# EAGLE schematic queso_dip_v49 (EAGLE 6.5.0)
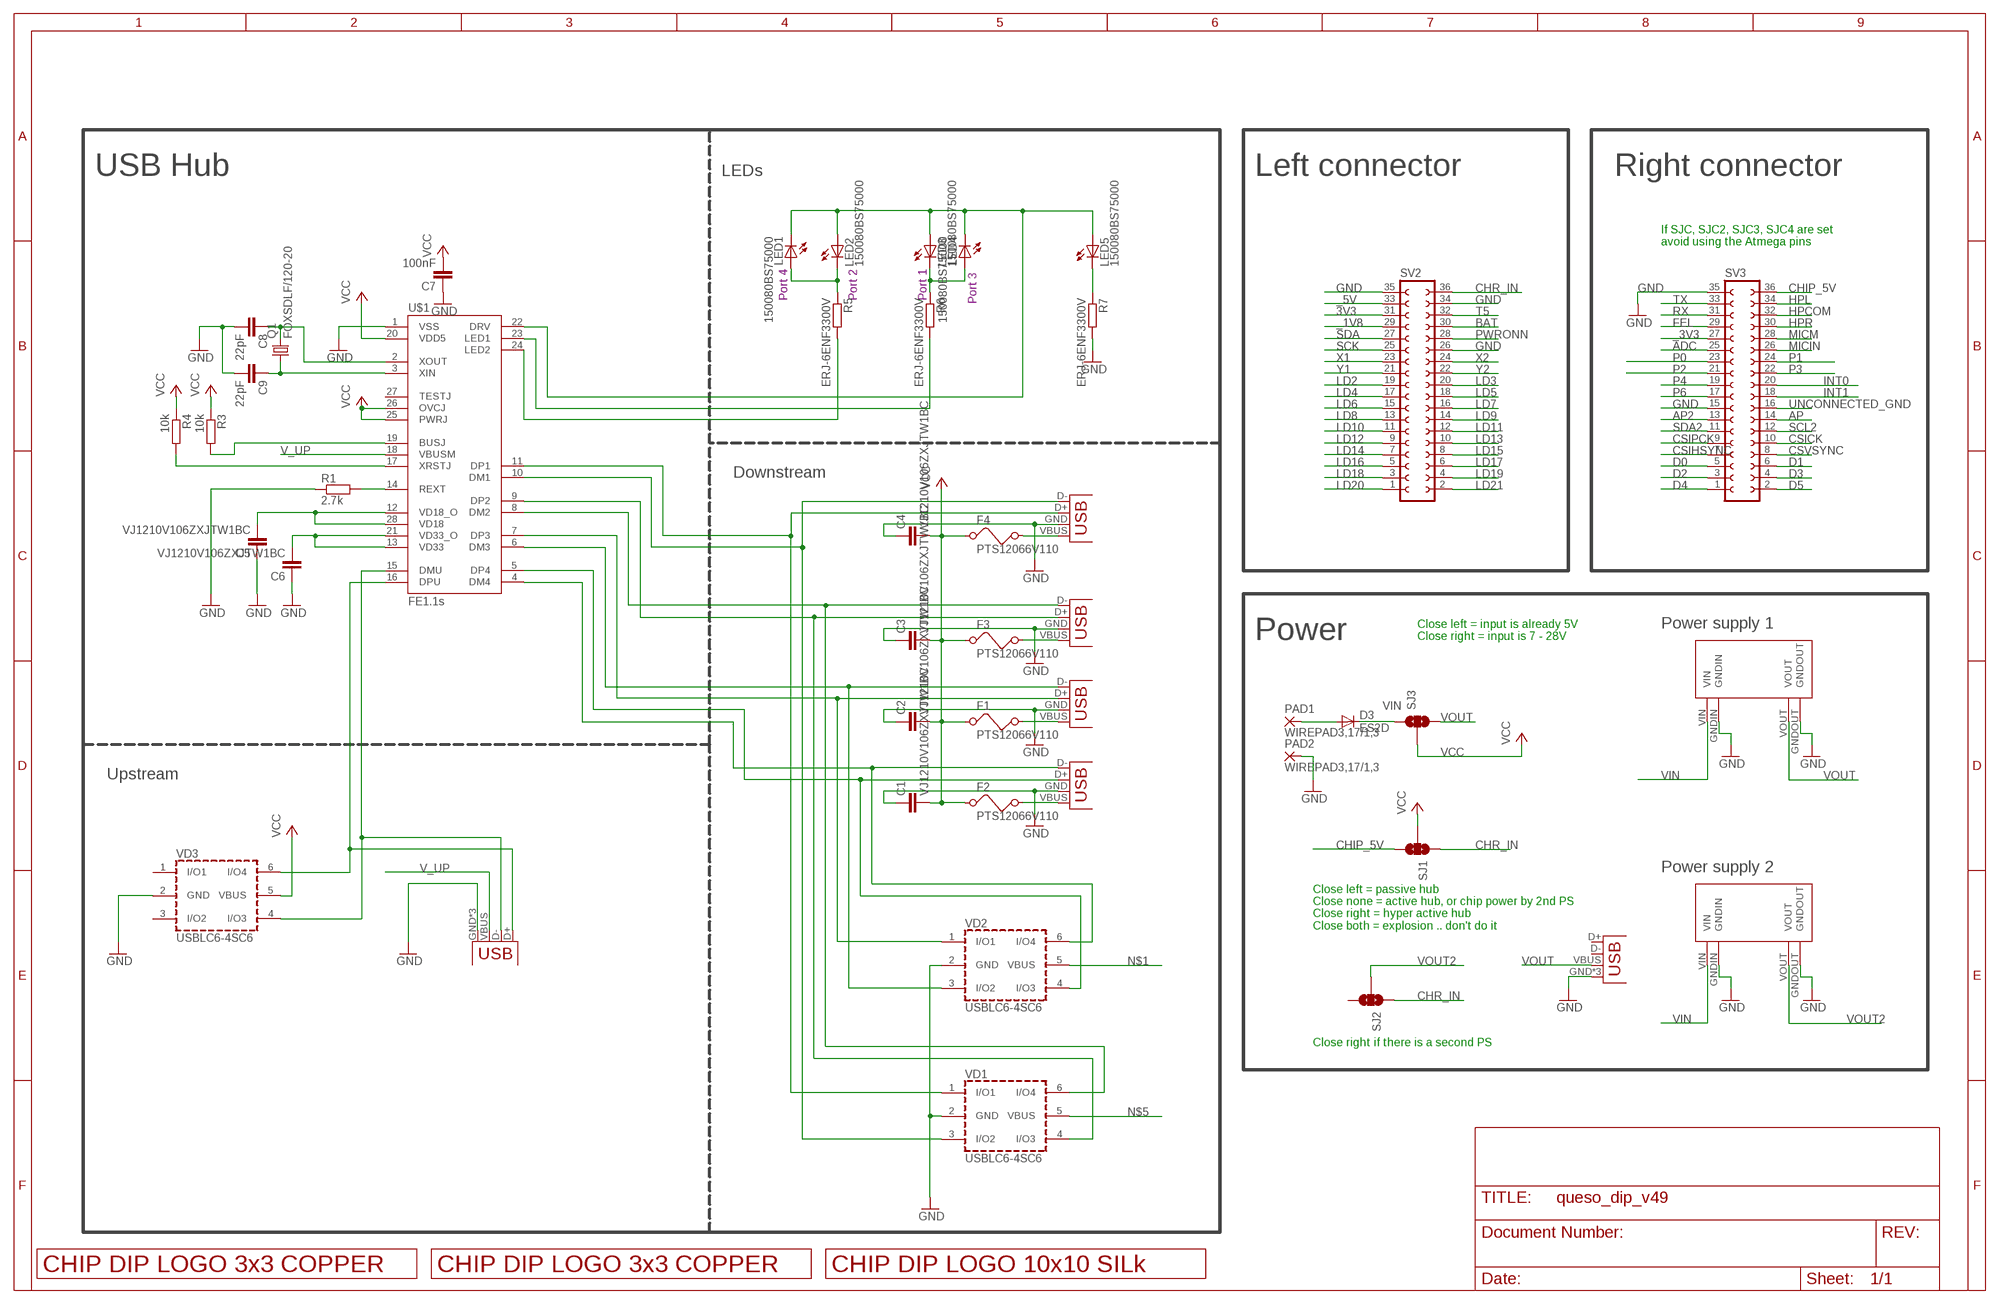
[diagram p0: schematic, sheet 1]

## Parts
C1  VJ1210V106ZXJTW1BC  C-EUC1210  [C1210]
C2  VJ1210V106ZXJTW1BC  C-EUC1210  [C1210]
C3  VJ1210V106ZXJTW1BC  C-EUC1210  [C1210]
C4  VJ1210V106ZXJTW1BC  C-EUC1210  [C1210]
C5  VJ1210V106ZXJTW1BC  C-EUC1210  [C1210]
C6  VJ1210V106ZXJTW1BC  C-EUC1210  [C1210]
C7  100nF  C-EUC0805  [C0805]
C8  22pF  C-EUC0805  [C0805]
C9  22pF  C-EUC0805  [C0805]
D3  ES2D  [SMB]
DATA_USB  USBUSB-MICROB-SMT-DIP  [USB-MICROB-SMT-DIP]
F1  PTS12066V110  FUSED  [1210]
F2  PTS12066V110  FUSED  [1210]
F3  PTS12066V110  FUSED  [1210]
F4  PTS12066V110  FUSED  [1210]
LED1  150080BS75000  LEDCHIP-LED0805  [CHIP-LED0805]
LED2  150080BS75000  LEDCHIP-LED0805  [CHIP-LED0805]
LED3  150080BS75000  LEDCHIP-LED0805  [CHIP-LED0805]
LED4  150080BS75000  LEDCHIP-LED0805  [CHIP-LED0805]
LED5  150080BS75000  LEDCHIP-LED0805  [CHIP-LED0805]
PAD1  WIREPAD3,17/1,3  [3,17/1,3]
PAD2  WIREPAD3,17/1,3  [3,17/1,3]
POWER_USB  USBUSB-MICROB-SMT-DIP  [USB-MICROB-SMT-DIP]
Q1  FOXSDLF/120-20  CRYSTALSM49  [SM49]
R1  2.7k  R-EU_R0805  [R0805]
R3  10k  R-EU_R0805  [R0805]
R4  10k  R-EU_R0805  [R0805]
R5  ERJ-6ENF3300V  R-EU_R0805  [R0805]
R6  ERJ-6ENF3300V  R-EU_R0805  [R0805]
R7  ERJ-6ENF3300V  R-EU_R0805  [R0805]
SJ1  SOLDERJUMPER_2WAYT  [SJ_2]
SJ2  SOLDERJUMPER_2WAYT  [SJ_2]
SJ3  SOLDERJUMPER_2WAYT  [SJ_2]
SV2  FE18-2  [FE18-2]
SV3  FE18-2  [FE18-2]
U$1  FE1.1S  [FE1.1S_SSOP-28]
U$2  LOGO_3X3_COPPER  [LOGO_3X3_COPPER]
U$3  MP1584EN  [MP1584EN]
U$4  LOGO_3X3_COPPER  [LOGO_3X3_COPPER]
U$5  LOGO_10X10_SILK  [LOGO_10X10_SILK]
U$9  MP1584EN  [MP1584EN]
VD1  USBLC6-4SC6  [SOT-23-6L]
VD2  USBLC6-4SC6  [SOT-23-6L]
VD3  USBLC6-4SC6  [SOT-23-6L]
X1  USB-A-HU  [USB-A-HU]
X2  USB-A-HU  [USB-A-HU]
X3  USB-A-HU  [USB-A-HU]
X4  USB-A-HU  [USB-A-HU]

## Nets
3V3: SV2.31
_1V8: SV2.29
_3V3: SV3.27
_5V: SV2.33
ADC: SV3.25
AP: SV3.14
AP2: SV3.13
BAT: SV2.30
CHIP_5V: SJ1.3 SV3.36
CHR_IN: SJ1.1 SJ2.1 SV2.36
CSICK: SV3.10
CSIHSYNC: SV3.7
CSIPCK: SV3.9
CSVSYNC: SV3.8
D0: SV3.5
D1: SV3.6
D2: SV3.3
D3: SV3.4
D4: SV3.1
D5: SV3.2
DM1: U$1.10(DM1) VD1.3(I/O2) X4.D-(D+)
DM2: U$1.8(DM2) VD1.6(I/O4) X3.D-(D+)
DM3: U$1.6(DM3) VD2.3(I/O2) X2.D-(D+)
DM4: U$1.4(DM4) VD2.6(I/O4) X1.D-(D+)
DMU: DATA_USB.D- U$1.15(DMU) VD3.4(I/O3)
DP1: U$1.11(DP1) VD1.1(I/O1) X4.D+(D-)
DP2: U$1.9(DP2) VD1.4(I/O3) X3.D+(D-)
DP3: U$1.7(DP3) VD2.1(I/O1) X2.D+(D-)
DP4: U$1.5(DP4) VD2.4(I/O3) X1.D+(D-)
DPU: DATA_USB.D+ U$1.16(DPU) VD3.6(I/O4)
FEL: SV3.29
GND: C1.1 C2.1 C3.1 C4.1 C5.1 C6.1 C7.1 C8.2 C9.2 DATA_USB.GND DATA_USB.MT1(GND) DATA_USB.MT2(GND) PAD2.1(P) POWER_USB.GND POWER_USB.MT1(GND) POWER_USB.MT2(GND) R1.1 R7.2 SV2.26 SV2.34 SV2.35 SV3.15 SV3.35 U$1.1(VSS) U$3.GNDIN U$3.GNDOUT U$9.GNDIN U$9.GNDOUT VD1.2(GND) VD2.2(GND) VD3.2(GND) X1.GND(VBUS) X2.GND(VBUS) X3.GND(VBUS) X4.GND(VBUS)
HPCOM: SV3.32
HPL: SV3.34
HPR: SV3.30
INT0: SV3.20
INT1: SV3.18
LD2: SV2.19
LD3: SV2.20
LD4: SV2.17
LD5: SV2.18
LD6: SV2.15
LD7: SV2.16
LD8: SV2.13
LD9: SV2.14
LD10: SV2.11
LD11: SV2.12
LD12: SV2.9
LD13: SV2.10
LD14: SV2.7
LD15: SV2.8
LD16: SV2.5
LD17: SV2.6
LD18: SV2.3
LD19: SV2.4
LD20: SV2.1
LD21: SV2.2
MICIN: SV3.26
MICM: SV3.28
N$1: F2.2 VD2.5(VBUS) X1.VBUS(GND)
N$2: D3.A PAD1.1(P)
N$3: F4.2 X4.VBUS(GND)
N$4: F1.2 X2.VBUS(GND)
N$5: F3.2 VD1.5(VBUS) X3.VBUS(GND)
N$14: R5.2 U$1.24(LED2)
N$15: R6.2 U$1.23(LED1)
N$17: C6.2 U$1.13(VD33) U$1.21(VD33_O)
N$18: C5.2 U$1.12(VD18_O) U$1.28(VD18)
N$22: R1.2 U$1.14(REXT)
N$24: R4.2 U$1.17(XRSTJ)
N$25: R3.2 U$1.19(BUSJ)
N$27: C8.1 Q1.2 U$1.2(XOUT)
N$28: C9.1 Q1.1 U$1.3(XIN)
N$29: LED5.C R7.1
N$30: LED3.C LED4.A R6.1
N$31: LED1.A LED2.C R5.1
N$32: LED1.C LED2.A LED3.A LED4.C LED5.A U$1.22(DRV)
P0: SV3.23
P1: SV3.24
P2: SV3.21
P3: SV3.22
P4: SV3.19
P6: SV3.17
PWRONN: SV2.28
RX: SV3.31
SCK: SV2.25
SCL2: SV3.12
SDA: SV2.27
SDA2: SV3.11
T5: SV2.32
TX: SV3.33
UNCONNECTED_GND: SV3.16
V_UP: DATA_USB.VBUS U$1.18(VBUSM)
VCC: C1.2 C2.2 C3.2 C4.2 C7.2 F1.1 F2.1 F3.1 F4.1 R3.1 R4.1 SJ1.2 SJ3.2 U$1.20(VDD5) U$1.25(PWRJ) U$1.26(OVCJ) VD3.5(VBUS)
VIN: D3.C SJ3.1 U$3.VIN U$9.VIN
VOUT: POWER_USB.VBUS SJ3.3 U$9.VOUT
VOUT2: SJ2.2 U$3.VOUT
X1: SV2.23
X2: SV2.24
Y1: SV2.21
Y2: SV2.22
Unconnected: POWER_USB.D+ POWER_USB.D- SJ2.3 U$1.27(TESTJ) VD3.1(I/O1) VD3.3(I/O2)

## Notes on the sheet
- USB Hub | LEDs | Left connector | Right connector
- If SJC, SJC2, SJC3, SJC4 are set 
  avoid using the Atmega pins
- Port 4 | Port 2 | Port 1
- Port 3
- Downstream
- Power supply 1
- Power
- Close left = input is already 5V
  Close right = input is 7 - 28V
- Upstream
- Power supply 2
- Close left = passive hub
  Close none = active hub, or chip power by 2nd PS
  Close right = hyper active hub
  Close both = explosion .. don't do it
- Close right if there is a second PS

## Library data of the parts
C1-C9 = rcl:C-EU: CAPACITOR, European symbol
D3 = diode:ES2D: DIODE super fast rectifier, 2 A
DATA_USB POWER_USB = Spark:USB
F1-F4 = m-pad-2.1:FUSE: Fuse's in various packages
LED1-LED5 = led:LED: LED OSRAM: - CHIPLED LG R971, LG N971, LY N971, LG Q971, LY Q971, LO R971, LY R971 LH N974, LH R974 LS Q976, LO Q976, LY Q976 LO Q996 - Hyper CHIPLED LW Q18S LB Q993, LB Q99A, LB R99A - SideLED LS A670, LO A670, LY A670, LG A670, LP A670 LB A673, LV A673, LT A673, LW A673 LH A674 LY A675 LS A676, LA A676, LO A676, LY A676, LW A676 LS A679, LY A679, LG A679 - Hyper Micro SIDELED® LS Y876, LA Y876, LO Y876, LY Y876 LT Y87S - SmartLED LW L88C, LW L88S LB L89C, LB L89S, LG L890 LS L89K, LO L89K, LY L89K LS L896, LA L896, LO L896, LY L896 - TOPLED LS T670, LO T670, LY T670, LG T670, LP T670 LSG T670, LSP T670, LSY T670, LOP T670, LYG T670 LG T671, LOG T671, LSG T671 LB T673, LV T673, LT T673, LW T673 LH T674 LS T676, LA T676, LO T676, LY T676, LB T676, LH T676, LSB T676, LW T676 LB T67C, LV T67C, LT T67C, LS T67K, LO T67K, LY T67K, LW E67C LS E67B, LA E67B, LO E67B, LY E67B, LB E67C, LV E67C, LT E67C LW T67C LS T679, LY T679, LG T679 LS T770, LO T770, LY T770, LG T770, LP T770 LB T773, LV T773, LT T773, LW T773 LH T774 LS E675, LA E675, LY E675, LS T675 LS T776, LA T776, LO T776, LY T776, LB T776 LHGB T686 LT T68C, LB T68C - Hyper Mini TOPLED® LB M676 - Mini TOPLED Santana® LG M470 LS M47K, LO M47K, LY M47K Source: http://www.osram.convergy.de LUXEON: - LUMILED® LXK2-PW12-R00, LXK2-PW12-S00, LXK2-PW14-U00, LXK2-PW14-V00 LXK2-PM12-R00, LXK2-PM12-S00, LXK2-PM14-U00 LXK2-PE12-Q00, LXK2-PE12-R00, LXK2-PE12-S00, LXK2-PE14-T00, LXK2-PE14-U00 LXK2-PB12-K00, LXK2-PB12-L00, LXK2-PB12-M00, LXK2-PB14-N00, LXK2-PB14-P00, LXK2-PB14-Q00 LXK2-PR12-L00, LXK2-PR12-M00, LXK2-PR14-Q00, LXK2-PR14-R00 LXK2-PD12-Q00, LXK2-PD12-R00, LXK2-PD12-S00 LXK2-PH12-R00, LXK2-PH12-S00 LXK2-PL12-P00, LXK2-PL12-Q00, LXK2-PL12-R00 Source: www.luxeon.com KINGBRIGHT: KA-3528ASYC Source: www.kingbright.com
PAD1 PAD2 = wirepad:WIREPAD: Wire PAD connect wire on PCB
Q1 = adafruit:CRYSTAL: CRYSTAL; OC_FARNELL: unknown; OC_NEWARK: unknown
R1 R3-R7 = rcl:R-EU_: RESISTOR, European symbol
SJ1-SJ3 = SparkFun-Retired:SOLDERJUMPER_2WAY: Solder Jumper 2 way solder jumper
SV2 SV3 = con-lsta:FE18-2: FEMALE HEADER; OC_FARNELL: unknown; OC_NEWARK: unknown
U$1 = imcom:FE1.1S: A USB 2.0 hub IC. http://www.jfd-ic.com/Documents/FE1.1s%20Data%20Sheet%20%28Rev.%201.0%29.pdf
U$2 U$4 = logo:LOGO_3X3_COPPER
U$3 U$9 = power_supply:MP1584EN
U$5 = logo:LOGO_10X10_SILK
VD1-VD3 = usblc6:USBLC6-4: Automotive very low capacitance ESD protection 4 line Features 4 data-line protection Protects V BUS Very low capacitance: 3 pF Very low leakage current: 10 nA SOT23-6L package RoHS compliant AEC Q101 qualified
X1-X4 = con-usb:USB: USB Connectors